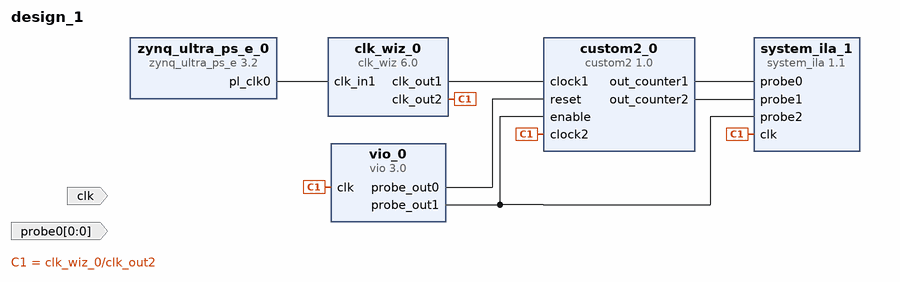
[diagram p0: block diagram of the top level]
# Vivado block design design_1, xczu9eg-ffvb1156-2-e, Vivado 2018.3
create_bd_design design_1

create_bd_port -dir I -type clk clk
create_bd_port -dir I -from 0 -to 0 probe0

create_bd_cell -type ip -vlnv xilinx.com:hls:custom2:1.0 custom2_0
create_bd_cell -type ip -vlnv xilinx.com:ip:zynq_ultra_ps_e:3.2 zynq_ultra_ps_e_0
set_property -dict {CONFIG.PSU__DDR_HIGH_ADDRESS_GUI_ENABLE 0 CONFIG.PSU__USE__M_AXI_GP2 0} [get_bd_cells zynq_ultra_ps_e_0]
# 2 more settings of zynq_ultra_ps_e_0 are not shown: defaults, MIO pin electricals, DDR timing, and values the tool derives
create_bd_cell -type ip -vlnv xilinx.com:ip:vio:3.0 vio_0
set_property -dict {CONFIG.C_NUM_PROBE_IN 0 CONFIG.C_NUM_PROBE_OUT 2 CONFIG.C_PROBE_OUT0_INIT_VAL 0x1} [get_bd_cells vio_0]
create_bd_cell -type ip -vlnv xilinx.com:ip:clk_wiz:6.0 clk_wiz_0
set_property -dict [list \
  CONFIG.CLKOUT2_JITTER 90.201 \
  CONFIG.CLKOUT2_PHASE_ERROR 87.180 \
  CONFIG.CLKOUT2_REQUESTED_OUT_FREQ 400.000 \
  CONFIG.CLKOUT2_USED true \
  CONFIG.MMCM_CLKOUT1_DIVIDE 3 \
  CONFIG.MMCM_DIVCLK_DIVIDE 1 \
  CONFIG.NUM_OUT_CLKS 2 \
  CONFIG.USE_LOCKED false \
  CONFIG.USE_RESET false \
] [get_bd_cells clk_wiz_0]
create_bd_cell -type ip -vlnv xilinx.com:ip:system_ila:1.1 system_ila_1
set_property -dict {CONFIG.C_DATA_DEPTH 4096 CONFIG.C_MON_TYPE NATIVE CONFIG.C_NUM_OF_PROBES 3} [get_bd_cells system_ila_1]

# ---- connections ----

connect_bd_net [get_bd_pins zynq_ultra_ps_e_0/pl_clk0] [get_bd_pins clk_wiz_0/clk_in1]
connect_bd_net [get_bd_pins clk_wiz_0/clk_out1] [get_bd_pins custom2_0/clock1]
connect_bd_net [get_bd_pins clk_wiz_0/clk_out2] [get_bd_pins custom2_0/clock2] [get_bd_pins vio_0/clk] [get_bd_pins system_ila_1/clk]
connect_bd_net -net custom2_0_out_counter1 [get_bd_pins custom2_0/out_counter1] [get_bd_pins system_ila_1/probe0]
connect_bd_net -net custom2_0_out_counter2 [get_bd_pins custom2_0/out_counter2] [get_bd_pins system_ila_1/probe1]
connect_bd_net -net vio_0_probe_out1 [get_bd_pins vio_0/probe_out1] [get_bd_pins custom2_0/enable] [get_bd_pins system_ila_1/probe2]
connect_bd_net [get_bd_pins vio_0/probe_out0] [get_bd_pins custom2_0/reset]
set_property HDL_ATTRIBUTE.DEBUG true [get_bd_nets custom2_0_out_counter1]
set_property HDL_ATTRIBUTE.MARK_DEBUG true [get_bd_nets custom2_0_out_counter1]
set_property HDL_ATTRIBUTE.DEBUG true [get_bd_nets custom2_0_out_counter2]
set_property HDL_ATTRIBUTE.MARK_DEBUG true [get_bd_nets custom2_0_out_counter2]
set_property HDL_ATTRIBUTE.DEBUG true [get_bd_nets vio_0_probe_out1]
set_property HDL_ATTRIBUTE.MARK_DEBUG true [get_bd_nets vio_0_probe_out1]

validate_bd_design
save_bd_design
